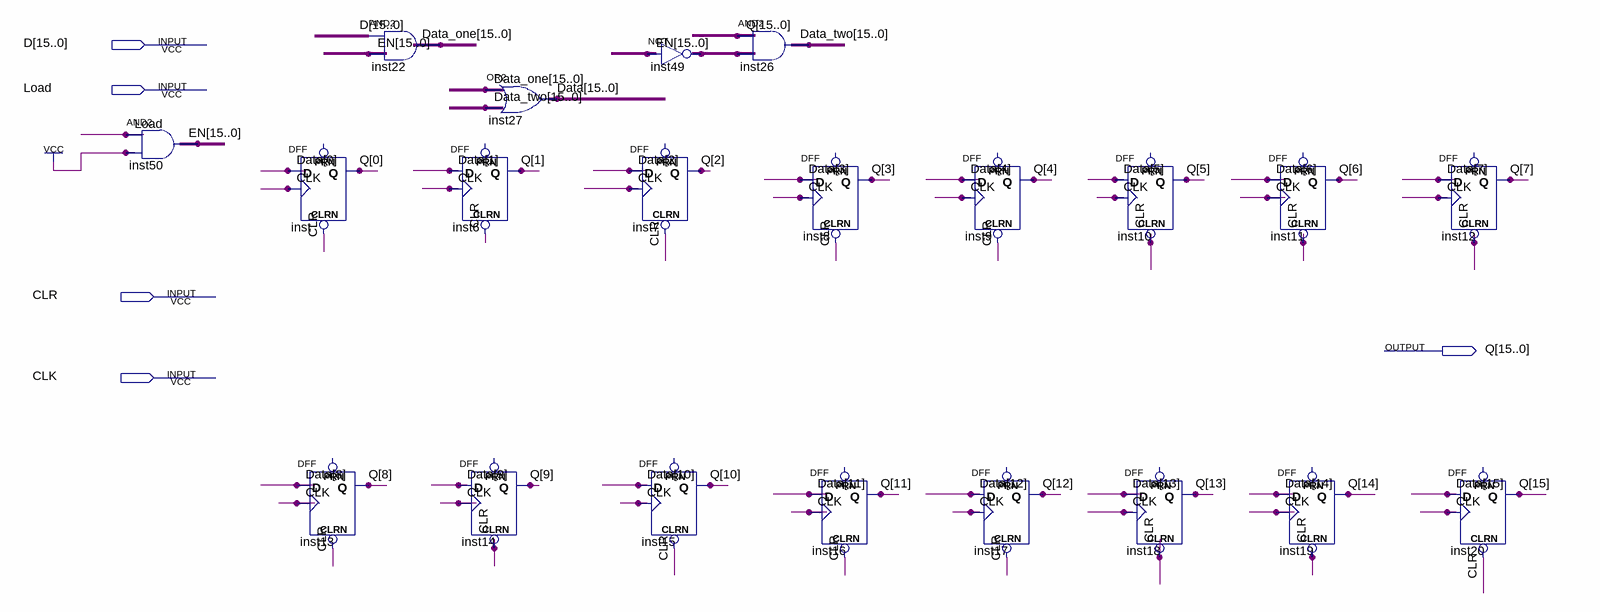
[diagram p0: schematic sheet]
// Quartus schematic register.bdf as structural Verilog: 21 symbols, 5 pins
module register (
  input  [15:0] D,
  input  Load,
  input  CLR,
  input  CLK,
  output [15:0] Q
);

  wire [15:0] Data, Data_one, Data_two, EN, inst49_out;

  assign EN = {16{Load}} & {16{1'b1}};  // AND2 inst50, 16 bits wide
  DFF inst (.CLRN(CLR), .CLK(CLK), .D(Data[0]), .Q(Q[0]));  // open: PRN
  DFF inst13 (.CLRN(CLR), .CLK(CLK), .D(Data[8]), .Q(Q[8]));  // open: PRN
  assign Data_one = D & EN;  // AND2 inst22, 16 bits wide
  DFF inst6 (.CLRN(CLR), .CLK(CLK), .D(Data[1]), .Q(Q[1]));  // open: PRN
  DFF inst14 (.CLRN(CLR), .CLK(CLK), .D(Data[9]), .Q(Q[9]));  // open: PRN
  assign Data = Data_one | Data_two;  // OR2 inst27, 16 bits wide
  assign inst49_out = ~EN;  // NOT inst49, 16 bits wide
  DFF inst7 (.CLRN(CLR), .CLK(CLK), .D(Data[2]), .Q(Q[2]));  // open: PRN
  DFF inst15 (.CLRN(CLR), .CLK(CLK), .D(Data[10]), .Q(Q[10]));  // open: PRN
  assign Data_two = Q & inst49_out;  // AND2 inst26, 16 bits wide
  DFF inst8 (.CLRN(CLR), .CLK(CLK), .D(Data[3]), .Q(Q[3]));  // open: PRN
  DFF inst16 (.CLRN(CLR), .CLK(CLK), .D(Data[11]), .Q(Q[11]));  // open: PRN
  DFF inst9 (.CLRN(CLR), .CLK(CLK), .D(Data[4]), .Q(Q[4]));  // open: PRN
  DFF inst17 (.CLRN(CLR), .CLK(CLK), .D(Data[12]), .Q(Q[12]));  // open: PRN
  DFF inst10 (.CLRN(CLR), .CLK(CLK), .D(Data[5]), .Q(Q[5]));  // open: PRN
  DFF inst18 (.CLRN(CLR), .CLK(CLK), .D(Data[13]), .Q(Q[13]));  // open: PRN
  DFF inst11 (.CLRN(CLR), .CLK(CLK), .D(Data[6]), .Q(Q[6]));  // open: PRN
  DFF inst19 (.CLRN(CLR), .CLK(CLK), .D(Data[14]), .Q(Q[14]));  // open: PRN
  DFF inst12 (.CLRN(CLR), .CLK(CLK), .D(Data[7]), .Q(Q[7]));  // open: PRN
  DFF inst20 (.CLRN(CLR), .CLK(CLK), .D(Data[15]), .Q(Q[15]));  // open: PRN
endmodule
